# Altium schematic sheet STM32F4.SchDoc
size A3
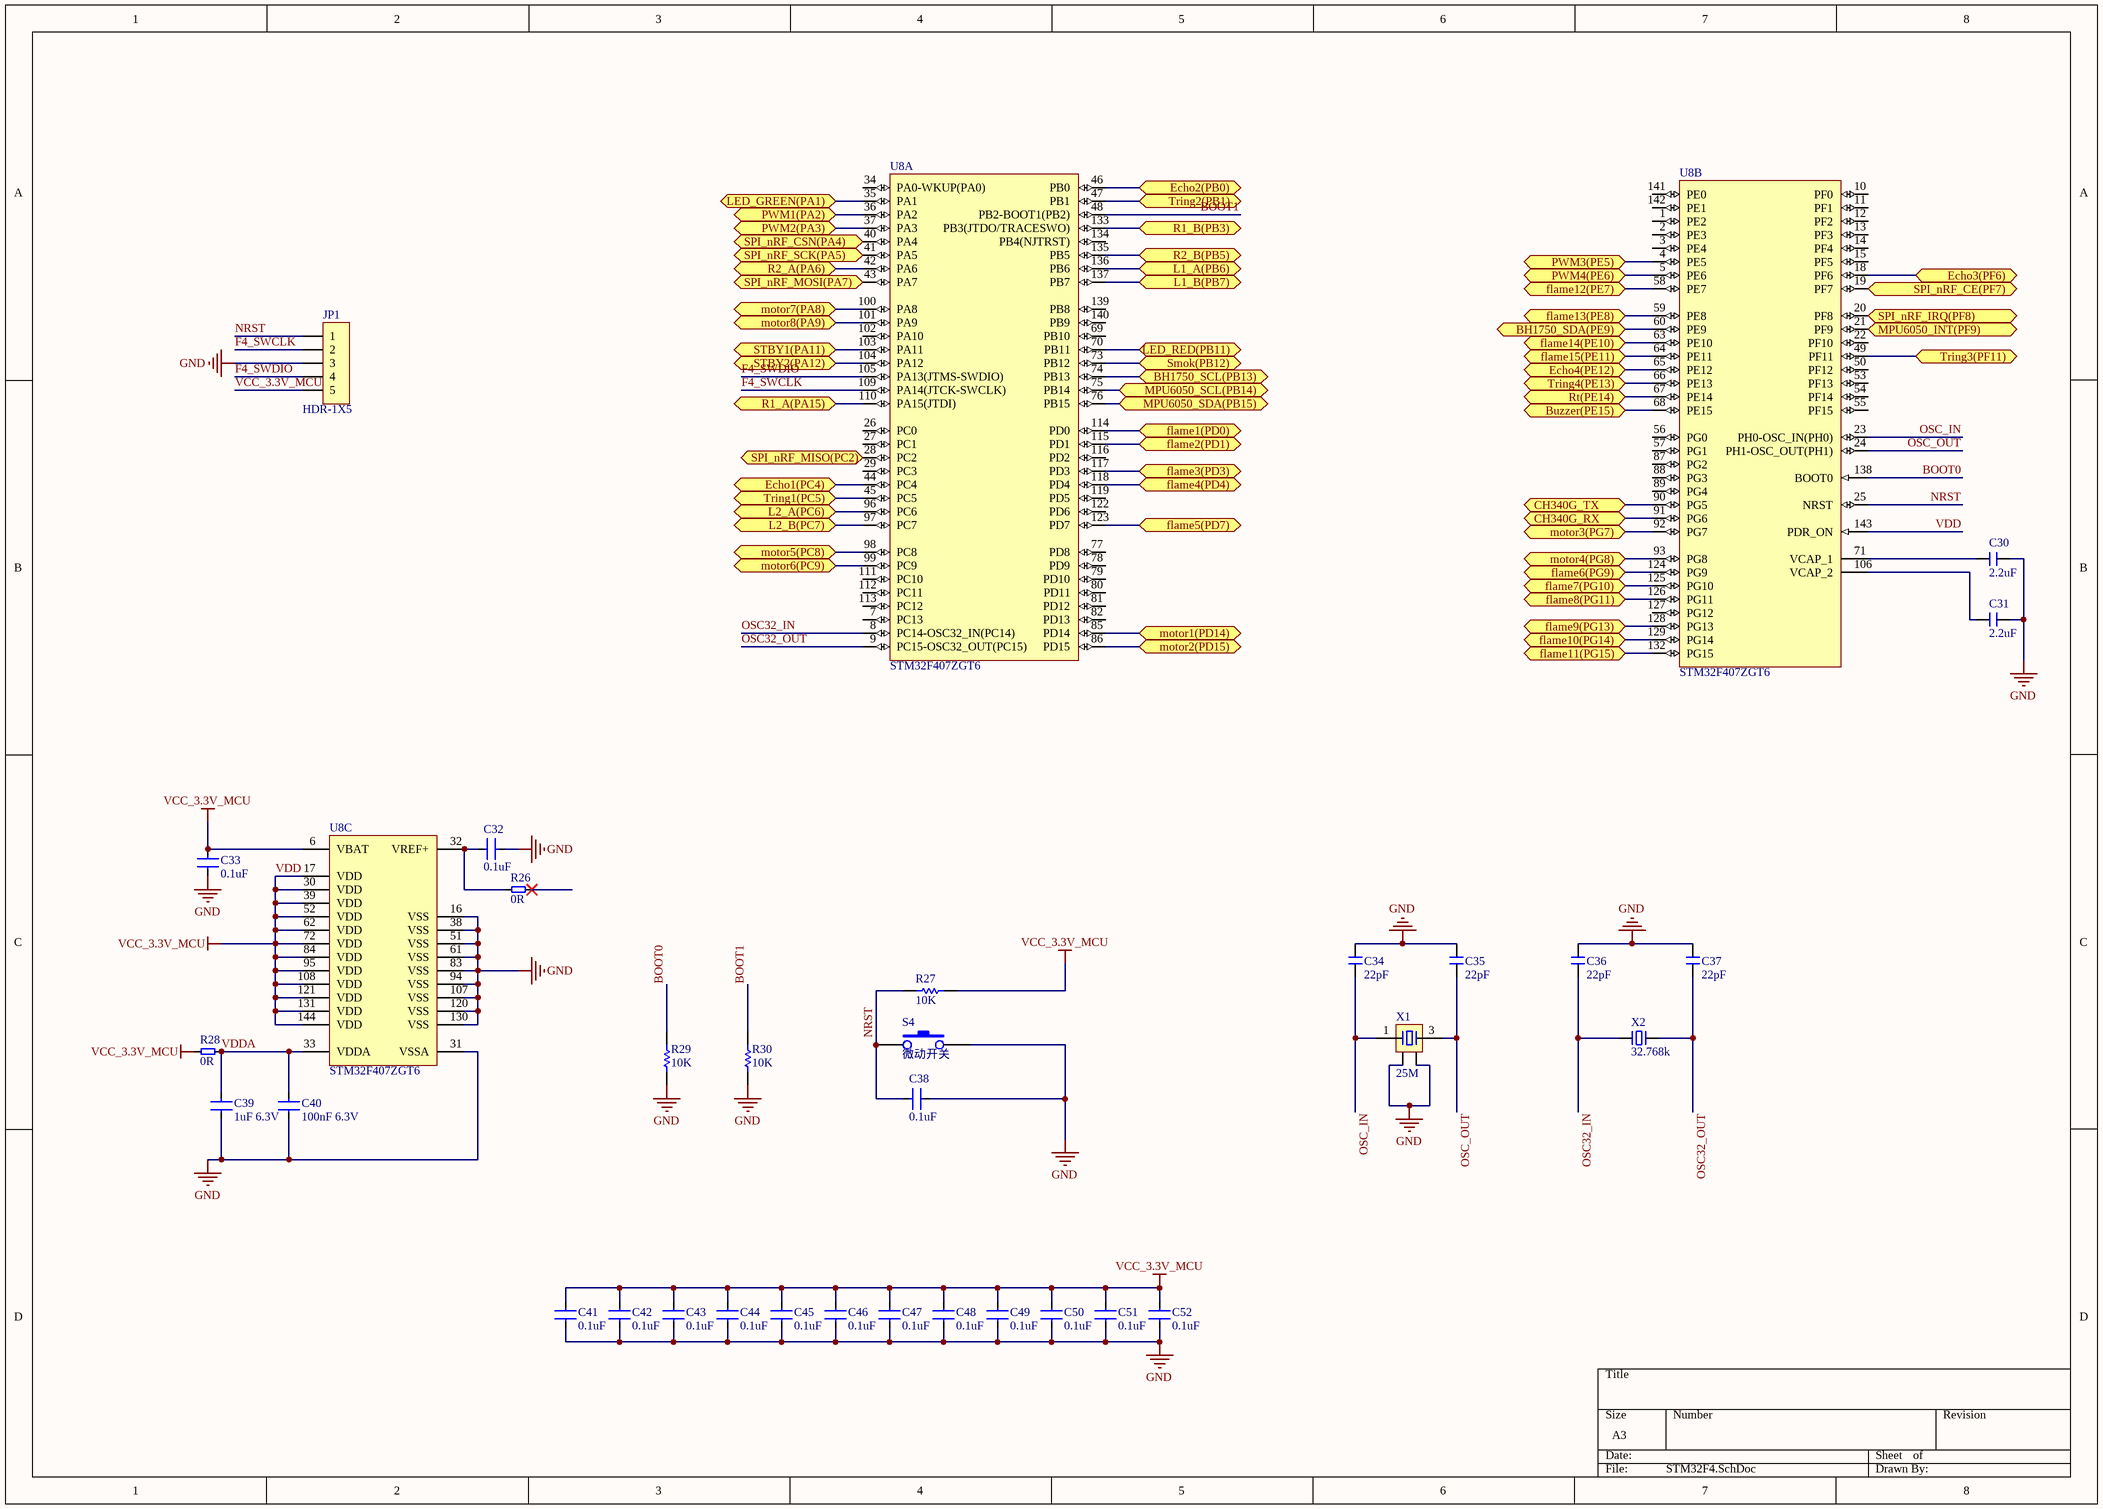
[diagram p0: STM32F4.SchDoc]

## Parts
C30  2.2uF  [0603_C]
C31  2.2uF  [0603_C]
C32  0.1uF  [0603_C]
C33  0.1uF  [0603_C]
C34  22pF  [0603_C]
C35  22pF  [0603_C]
C36  22pF  [0603_C]
C37  22pF  [0603_C]
C38  0.1uF  [0603_C]
C39  1uF 6.3V  [0603_C]
C40  100nF 6.3V  [0603_C]
C41  0.1uF  [0603_C]
C42  0.1uF  [0603_C]
C43  0.1uF  [0603_C]
C44  0.1uF  [0603_C]
C45  0.1uF  [0603_C]
C46  0.1uF  [0603_C]
C47  0.1uF  [0603_C]
C48  0.1uF  [0603_C]
C49  0.1uF  [0603_C]
C50  0.1uF  [0603_C]
C51  0.1uF  [0603_C]
C52  0.1uF  [0603_C]
JP1  HDR-1X5  [XH2.54-WI-5P]
R26  0R  [0603_L]
R27  10K  [0603_R]
R28  0R  [0603_L]
R29  10K  [0603_R]
R30  10K  [0603_R]
S4  微动开关  [微动开关-1]
U8  STM32F407ZGT6  [STM-LQFP144_N]  (parts A,B,C of 3)
X1  25M  [SMD-3225_4P]
X2  32.768k  [SMD-3215_2P FC - 135]

## Ports
BH1750_SCL(PB13) (bidir), BH1750_SDA(PE9) (bidir), Buzzer(PE15) (bidir), CH340G_RX (bidir), CH340G_TX (bidir), Echo1(PC4) (bidir), Echo2(PB0) (bidir), Echo3(PF6) (bidir), Echo4(PE12) (bidir), flame1(PD0) (bidir), flame2(PD1) (bidir), flame3(PD3) (bidir), flame4(PD4) (bidir), flame5(PD7) (bidir), flame6(PG9) (bidir), flame7(PG10) (bidir), flame8(PG11) (bidir), flame9(PG13) (bidir), flame10(PG14) (bidir), flame11(PG15) (bidir), flame12(PE7) (bidir), flame13(PE8) (bidir), flame14(PE10) (bidir), flame15(PE11) (bidir), L1_A(PB6) (bidir), L1_B(PB7) (bidir), L2_A(PC6) (bidir), L2_B(PC7) (bidir), LED_GREEN(PA1) (bidir), LED_RED(PB11) (bidir), motor1(PD14) (bidir), motor2(PD15) (bidir), motor3(PG7) (bidir), motor4(PG8) (bidir), motor5(PC8) (bidir), motor6(PC9) (bidir), motor7(PA8) (bidir), motor8(PA9) (bidir), MPU6050_INT(PF9) (bidir), MPU6050_SCL(PB14) (bidir), MPU6050_SDA(PB15) (bidir), PWM1(PA2) (bidir), PWM2(PA3) (bidir), PWM3(PE5) (bidir), PWM4(PE6) (bidir), R1_A(PA15) (bidir), R1_B(PB3) (bidir), R2_A(PA6) (bidir), R2_B(PB5) (bidir), Rt(PE14) (bidir), Smok(PB12) (bidir), SPI_nRF_CE(PF7) (bidir), SPI_nRF_CSN(PA4) (bidir), SPI_nRF_IRQ(PF8) (bidir), SPI_nRF_MISO(PC2) (bidir), SPI_nRF_MOSI(PA7) (bidir), SPI_nRF_SCK(PA5) (bidir), STBY1(PA11) (bidir), STBY2(PA12) (bidir), Tring1(PC5) (bidir), Tring2(PB1) (bidir), Tring3(PF11) (bidir), Tring4(PE13) (bidir)

## Nets
GND: C30.2 C31.1 C32.2 C33.1 C34.1 C35.1 C36.1 C37.1 C38.2 C39.2 C40.2 C41.1 C42.1 C43.1 C44.1 C45.1 C46.1 C47.1 C48.1 C49.1 C50.1 C51.1 C52.1 JP1.3 R29.2 R30.2 S4.2 U8.16(VSS) U8.31(VSSA) U8.38(VSS) U8.51(VSS) U8.61(VSS) U8.83(VSS) U8.94(VSS) U8.107(VSS) U8.120(VSS) U8.130(VSS) X1.2 X1.4
VCC_3.3V_MCU: C33.2 C41.2 C42.2 C43.2 C44.2 C45.2 C46.2 C47.2 C48.2 C49.2 C50.2 C51.2 C52.2 JP1.5 R27.2 R28.1 U8.6(VBAT) U8.17(VDD) U8.30(VDD) U8.39(VDD) U8.52(VDD) U8.62(VDD) U8.72(VDD) U8.84(VDD) U8.95(VDD) U8.108(VDD) U8.121(VDD) U8.131(VDD) U8.143(PDR_ON) U8.144(VDD)  [also labelled VDD]
BH1750_SCL(PB13): U8.74(PB13) ; port BH1750_SCL(PB13)
BH1750_SDA(PE9): U8.60(PE9) ; port BH1750_SDA(PE9)
BOOT0: R29.1 U8.138(BOOT0)
BOOT1: R30.1 U8.48(PB2-BOOT1(PB2))
Buzzer(PE15): U8.68(PE15) ; port Buzzer(PE15)
CH340G_RX: U8.91(PG6) ; port CH340G_RX
CH340G_TX: U8.90(PG5) ; port CH340G_TX
Echo1(PC4): U8.44(PC4) ; port Echo1(PC4)
Echo2(PB0): U8.46(PB0) ; port Echo2(PB0)
Echo3(PF6): U8.18(PF6) ; port Echo3(PF6)
Echo4(PE12): U8.65(PE12) ; port Echo4(PE12)
F4_SWCLK: JP1.2 U8.109(PA14(JTCK-SWCLK))
F4_SWDIO: JP1.4 U8.105(PA13(JTMS-SWDIO))
flame1(PD0): U8.114(PD0) ; port flame1(PD0)
flame2(PD1): U8.115(PD1) ; port flame2(PD1)
flame3(PD3): U8.117(PD3) ; port flame3(PD3)
flame4(PD4): U8.118(PD4) ; port flame4(PD4)
flame5(PD7): U8.123(PD7) ; port flame5(PD7)
flame6(PG9): U8.124(PG9) ; port flame6(PG9)
flame7(PG10): U8.125(PG10) ; port flame7(PG10)
flame8(PG11): U8.126(PG11) ; port flame8(PG11)
flame9(PG13): U8.128(PG13) ; port flame9(PG13)
flame10(PG14): U8.129(PG14) ; port flame10(PG14)
flame11(PG15): U8.132(PG15) ; port flame11(PG15)
flame12(PE7): U8.58(PE7) ; port flame12(PE7)
flame13(PE8): U8.59(PE8) ; port flame13(PE8)
flame14(PE10): U8.63(PE10) ; port flame14(PE10)
flame15(PE11): U8.64(PE11) ; port flame15(PE11)
L1_A(PB6): U8.136(PB6) ; port L1_A(PB6)
L1_B(PB7): U8.137(PB7) ; port L1_B(PB7)
L2_A(PC6): U8.96(PC6) ; port L2_A(PC6)
L2_B(PC7): U8.97(PC7) ; port L2_B(PC7)
LED_GREEN(PA1): U8.35(PA1) ; port LED_GREEN(PA1)
LED_RED(PB11): U8.70(PB11) ; port LED_RED(PB11)
motor1(PD14): U8.85(PD14) ; port motor1(PD14)
motor2(PD15): U8.86(PD15) ; port motor2(PD15)
motor3(PG7): U8.92(PG7) ; port motor3(PG7)
motor4(PG8): U8.93(PG8) ; port motor4(PG8)
motor5(PC8): U8.98(PC8) ; port motor5(PC8)
motor6(PC9): U8.99(PC9) ; port motor6(PC9)
motor7(PA8): U8.100(PA8) ; port motor7(PA8)
motor8(PA9): U8.101(PA9) ; port motor8(PA9)
MPU6050_INT(PF9): U8.21(PF9) ; port MPU6050_INT(PF9)
MPU6050_SCL(PB14): U8.75(PB14) ; port MPU6050_SCL(PB14)
MPU6050_SDA(PB15): U8.76(PB15) ; port MPU6050_SDA(PB15)
NRST: C38.1 JP1.1 R27.1 S4.1 U8.25(NRST)
OSC32_IN: C36.2 U8.8(PC14-OSC32_IN(PC14)) X2.1
OSC32_OUT: C37.2 U8.9(PC15-OSC32_OUT(PC15)) X2.2
OSC_IN: C34.2 U8.23(PH0-OSC_IN(PH0)) X1.1
OSC_OUT: C35.2 U8.24(PH1-OSC_OUT(PH1)) X1.3
PWM1(PA2): U8.36(PA2) ; port PWM1(PA2)
PWM2(PA3): U8.37(PA3) ; port PWM2(PA3)
PWM3(PE5): U8.4(PE5) ; port PWM3(PE5)
PWM4(PE6): U8.5(PE6) ; port PWM4(PE6)
R1_A(PA15): U8.110(PA15(JTDI)) ; port R1_A(PA15)
R1_B(PB3): U8.133(PB3(JTDO/TRACESWO)) ; port R1_B(PB3)
R2_A(PA6): U8.42(PA6) ; port R2_A(PA6)
R2_B(PB5): U8.135(PB5) ; port R2_B(PB5)
Rt(PE14): U8.67(PE14) ; port Rt(PE14)
Smok(PB12): U8.73(PB12) ; port Smok(PB12)
SPI_nRF_CE(PF7): U8.19(PF7) ; port SPI_nRF_CE(PF7)
SPI_nRF_CSN(PA4): U8.40(PA4) ; port SPI_nRF_CSN(PA4)
SPI_nRF_IRQ(PF8): U8.20(PF8) ; port SPI_nRF_IRQ(PF8)
SPI_nRF_MISO(PC2): U8.28(PC2) ; port SPI_nRF_MISO(PC2)
SPI_nRF_MOSI(PA7): U8.43(PA7) ; port SPI_nRF_MOSI(PA7)
SPI_nRF_SCK(PA5): U8.41(PA5) ; port SPI_nRF_SCK(PA5)
STBY1(PA11): U8.103(PA11) ; port STBY1(PA11)
STBY2(PA12): U8.104(PA12) ; port STBY2(PA12)
Tring1(PC5): U8.45(PC5) ; port Tring1(PC5)
Tring2(PB1): U8.47(PB1) ; port Tring2(PB1)
Tring3(PF11): U8.49(PF11) ; port Tring3(PF11)
Tring4(PE13): U8.66(PE13) ; port Tring4(PE13)
VDDA: C39.1 C40.1 R28.2 U8.33(VDDA)
NetC30_1: C30.1 U8.71(VCAP_1)
NetC31_2: C31.2 U8.106(VCAP_2)
NetC32_1: C32.1 R26.1 U8.32(VREF+)

Not connected (* = marked no-connect by the designer): R26 2*; U8 1(PE2) 2(PE3) 3(PE4) 7(PC13) 10(PF0) 11(PF1) 12(PF2) 13(PF3) 14(PF4) 15(PF5) 22(PF10) 26(PC0) 27(PC1) 29(PC3) 34(PA0-WKUP(PA0)) 50(PF12) 53(PF13) 54(PF14) 55(PF15) 56(PG0) 57(PG1) 69(PB10) 77(PD8) 78(PD9) 79(PD10) 80(PD11) 81(PD12) 82(PD13) 87(PG2) 88(PG3) 89(PG4) 102(PA10) 111(PC10) 112(PC11) 113(PC12) 116(PD2) 119(PD5) 122(PD6) 127(PG12) 134(PB4(NJTRST)) 139(PB8) 140(PB9) 141(PE0) 142(PE1)

## Library data of the parts
C30 C31 C34-C37 = C: 无极性贴片电容
C32 C33 C38-C52 = C0805
JP1 = Header 5: 5P接插件
R26 R28 = R0805
R27 R29 R30 = Res1: Resistor
U8 = STM32F407ZGT6: ARM Cortex-M4 32-bit MCU+FPU, 210 DMIPS, 1024 kB Flash, 192 kB Internal RAM, 114 I/Os, 144-pin LQFP, -40 to 85 degC, Tray; Manufacturer: STMicroelectronics; D/A Converter: 2x12-bit; FLASH Size (Prog) (kB): 1024; I/Os (High Current): 114; Internal RAM Size (kB): 192; Operating Frequency(F) (Processor speed) (MHz): 168; Supply Voltage(Vcc) max (V): 3.6; Supply Voltage(Vcc) min (V): 1.8; DatasheetVersion: Rev. 4; PackageVersion: Rev. 4, 06/2013; PackageReference: LQFP144; PackageDescription: 144-Pin Low Profile Quad Flat Package, 20 x 20 mm Body, 0.5 mm Pitch; Supplier 1: Digi-Key; Supplier Part Number 1: 497-11766-ND; Supplier 2: Newark; Supplier Part Number 2: 73T2334; Supplier 3: Mouser; Supplier Part Number 3: 511-STM32F407ZGT6; Core: ARM Cortex-M4; Packing: Tray; Mounting Technology: Surface Mount; PartNumber: STM32F407ZGT6; ComponentLink3Description: Package Specification; ComponentLink3URL: http://www.st.com/st-web-ui/static/active/en/resource/technical/document/datasheet/DM00037051.pdf
X1 = XTAL-4P: 4脚无源晶振
X2 = XTAL-2P: 2脚无源脚晶振